# Altium schematic sheet Sheet2.SchDoc
size A4; SheetNumber: 1; SheetTotal: 3
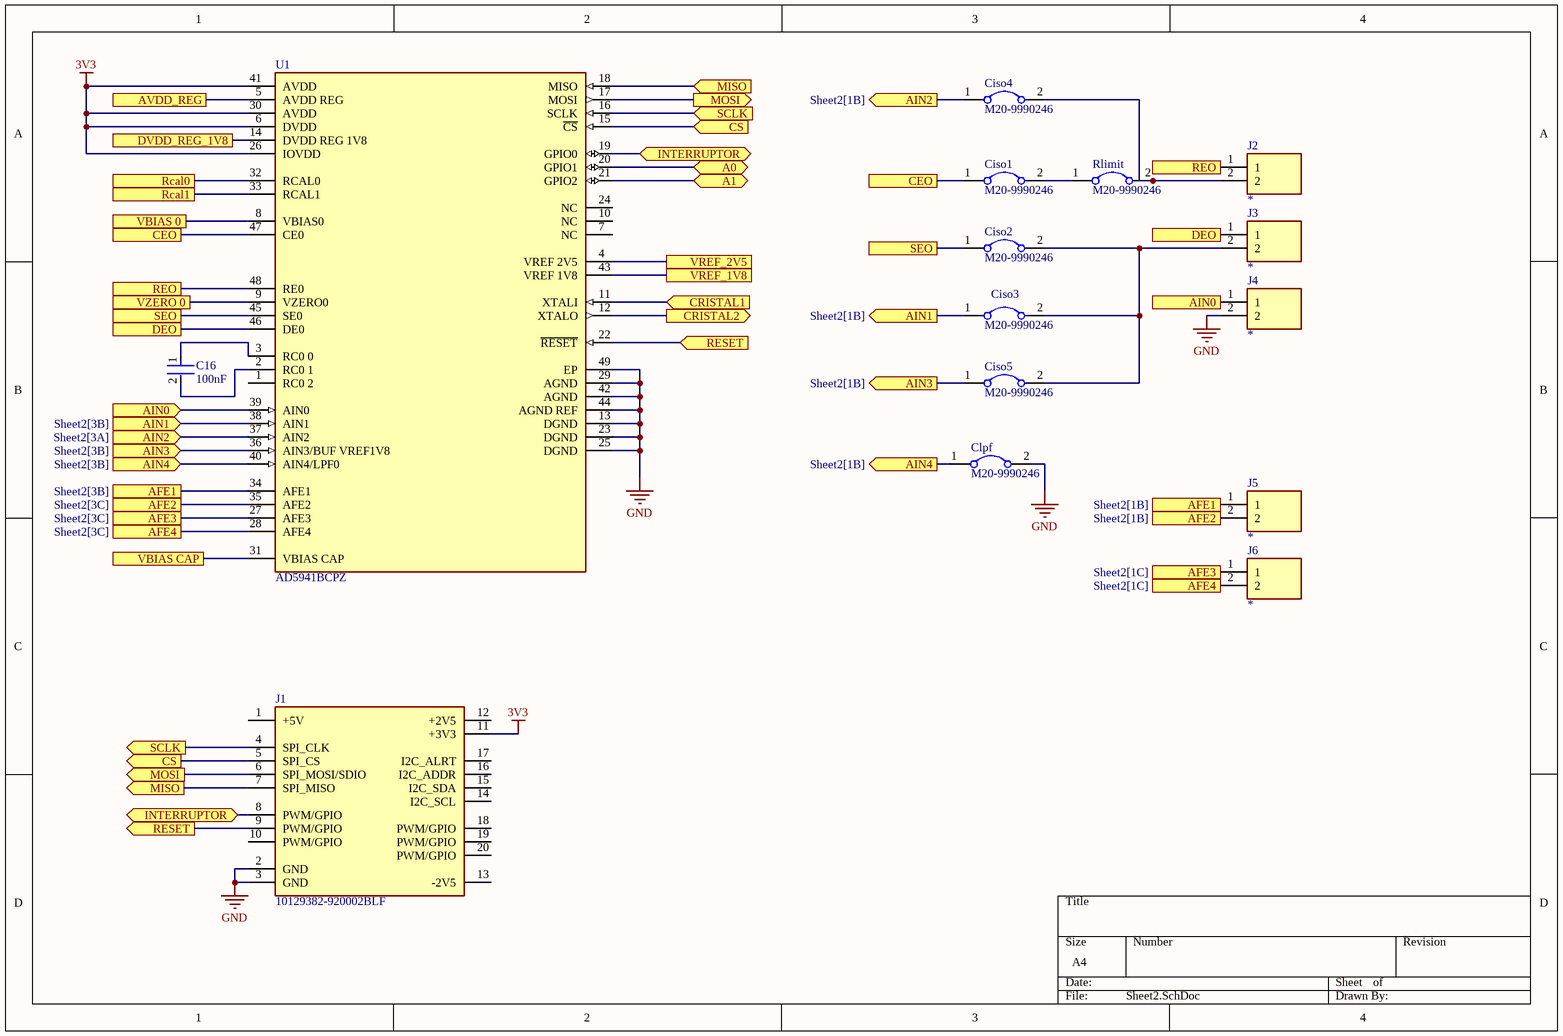
[diagram p0: Sheet2.SchDoc]

## Parts
C16  100nF  [FP-GRM18-0_15-MFG]
Ciso1  M20-9990246  [Male Header Socket 2-position]
Ciso2  M20-9990246  [Male Header Socket 2-position]
Ciso3  M20-9990246  [Male Header Socket 2-position]
Ciso4  M20-9990246  [Male Header Socket 2-position]
Ciso5  M20-9990246  [Male Header Socket 2-position]
Clpf  M20-9990246  [Male Header Socket 2-position]
J1  10129382-920002BLF  [Base Board Modular Connector (MALE)]
J2  (no value)  [Terminal Block 2-position]
J3  (no value)  [Terminal Block 2-position]
J4  (no value)  [Terminal Block 2-position]
J5  (no value)  [Terminal Block 2-position]
J6  (no value)  [Terminal Block 2-position]
Rlimit  M20-9990246  [Male Header Socket 2-position]
U1  AD5941BCPZ  [FP-CP-48-4-IPC_A]

## Ports
A0 (bidir, see Sheet3[1B]), A1 (bidir, see Sheet3[1B]), AFE1 (see Sheet2[1B]), AFE1 (see Sheet2[3B]), AFE2 (see Sheet2[1B]), AFE2 (see Sheet2[3C]), AFE3 (see Sheet2[1C]), AFE3 (see Sheet2[3C]), AFE4 (see Sheet2[1C]), AFE4 (see Sheet2[3C]), AIN0 (in, see Sheet2[3B]), AIN0 (out, see Sheet2[1B]), AIN1 (in, see Sheet2[3B]), AIN1 (out, see Sheet2[1B]), AIN2 (in, see Sheet2[3A]), AIN2 (out, see Sheet2[1B]), AIN3 (in, see Sheet2[3B]), AIN3 (out, see Sheet2[1B]), AIN4 (in, see Sheet2[3B]), AIN4 (out, see Sheet2[1B]), AVDD_REG (see Sheet4[2B]), CEO (see Sheet2[1A]), CEO (see Sheet2[3A]), CRISTAL1 (in, see Sheet4[3C]), CRISTAL2 (out, see Sheet4[4C]), CS (in, see Sheet2[1C]), CS (out, see Sheet2[2A]), DEO (see Sheet2[1B]), DEO (see Sheet2[3A]), DVDD_REG_1V8 (see Sheet4[2B]), INTERRUPTOR (bidir, see Sheet2[1D]), INTERRUPTOR (bidir, see Sheet2[2A]), MISO (in, see Sheet2[1D]), MISO (out, see Sheet2[2A]), MOSI (out, see Sheet2[1D]), MOSI (out, see Sheet2[2A]), Rcal0 (see Sheet3[2B]), Rcal1 (see Sheet3[3B]), REO (see Sheet2[1B]), REO (see Sheet2[3A]), RESET (in, see Sheet2[1D], Sheet4[3B]), RESET (out, see Sheet2[2B], Sheet4[3B]), SCLK (in, see Sheet2[1C]), SCLK (out, see Sheet2[2A]), SEO (see Sheet2[1B]), SEO (see Sheet2[3A]), VBIAS 0 (see Sheet4[2B]), VBIAS CAP (see Sheet4[1C]), VREF_1V8 (see Sheet4[2C]), VREF_2V5 (see Sheet4[1B]), VZERO 0 (see Sheet4[1C])

## Nets
3V3: J1.11(+3V3) U1.6(DVDD) U1.26(IOVDD) U1.30(AVDD) U1.41(AVDD)
GND: Clpf.2 J1.2(GND) J1.3(GND) J4.2 U1.13(DGND) U1.23(DGND) U1.25(DGND) U1.29(AGND) U1.42(AGND) U1.44(AGND_REF) U1.49(EP)
A0: U1.20(GPIO1) ; port A0
A1: U1.21(GPIO2) ; port A1
AFE1: J5.1 U1.34(AFE1) ; port AFE1
AFE2: J5.2 U1.35(AFE2) ; port AFE2
AFE3: J6.1 U1.27(AFE3) ; port AFE3
AFE4: J6.2 U1.28(AFE4) ; port AFE4
AIN0: J4.1 U1.39(AIN0) ; port AIN0
AIN1: Ciso3.1 U1.38(AIN1) ; port AIN1
AIN2: Ciso4.1 U1.37(AIN2) ; port AIN2
AIN3: Ciso5.1 U1.36(AIN3/BUF_VREF1V8) ; port AIN3
AIN4: Clpf.1 U1.40(AIN4/LPF0) ; port AIN4
AVDD_REG: U1.5(AVDD_REG) ; port AVDD_REG
CEO: Ciso1.1 U1.47(CE0) ; port CEO
CRISTAL1: U1.11(XTALI) ; port CRISTAL1
CRISTAL2: U1.12(XTALO) ; port CRISTAL2
CS: J1.5(SPI_CS) U1.15(~{CS}) ; port CS
DEO: J3.1 U1.46(DE0) ; port DEO
DVDD_REG_1V8: U1.14(DVDD_REG_1V8) ; port DVDD_REG_1V8
INTERRUPTOR: J1.8(PWM/GPIO) U1.19(GPIO0) ; port INTERRUPTOR
MISO: J1.7(SPI_MISO) U1.18(MISO) ; port MISO
MOSI: J1.6(SPI_MOSI/SDIO) U1.17(MOSI) ; port MOSI
Rcal0: U1.32(RCAL0) ; port Rcal0
Rcal1: U1.33(RCAL1) ; port Rcal1
REO: J2.1 U1.48(RE0) ; port REO
RESET: J1.9(PWM/GPIO) U1.22(~{RESET}) ; port RESET
SCLK: J1.4(SPI_CLK) U1.16(SCLK) ; port SCLK
SEO: Ciso2.1 U1.45(SE0) ; port SEO
VBIAS 0: U1.8(VBIAS0) ; port VBIAS 0
VBIAS CAP: U1.31(VBIAS_CAP) ; port VBIAS CAP
VREF_1V8: U1.43(VREF_1V8) ; port VREF_1V8
VREF_2V5: U1.4(VREF_2V5) ; port VREF_2V5
VZERO 0: U1.9(VZERO0) ; port VZERO 0
NetC16_1: C16.1 U1.3(RC0_0)
NetC16_2: C16.2 U1.2(RC0_1)
NetCiso1_2: Ciso1.2 Rlimit.1
NetCiso2_2: Ciso2.2 Ciso3.2 Ciso5.2 J3.2
NetCiso4_2: Ciso4.2 J2.2 Rlimit.2

Not connected (* = marked no-connect by the designer): J1 1(+5V) 10(PWM/GPIO) 12(+2V5) 13(-2V5) 14(I2C_SCL) 15(I2C_SDA) 16(I2C_ADDR) 17(I2C_ALRT) 18(PWM/GPIO) 19(PWM/GPIO) 20(PWM/GPIO); U1 1(RC0_2) 7(NC) 10(NC) 24(NC)

## Library data of the parts
C16 = CMP-2000-05448-2: CAP CER 10UF 10V X5R 0603; Manufacturer Part Number: GRM188R61A106KE69D; Manufacturer: Murata; Temperature Coefficient: 15%; Material: Ceramic; Tolerance: 10%; Device Class L1: Passive Components; ComponentLink2Description: Datasheet; Height: 0.95mm; Package: GRM18-0.15; Octopart: https://octopart.com/grm188r61a106ke69d-murata-22851381; Value: 10uF; Digikey Description: CAP CER 10UF 10V X5R 0603; Temperature Range High: +85°C; Temperature Range Low: -55°C; Temperature Characteristic: X5R; Capacitance: 10uF; RoHS: TRUE; Device Class L2: Capacitors; ComponentLink2URL: https://search.murata.co.jp/Ceramy/image/img/A01X/G101/ENG/GRM188R61A106KE69-01A.pdf; Device Class L3: Ceramic Capacitors; Lead Free: Yes; Mouser Description: Multilayer Ceramic Capacitors MLCC - SMD/SMT 0603 10uF 10volts X5R + - 10%; Category: Cap; Voltage Rating: 10V; Temperature: -55°C to +85°C; Automotive: No
Ciso1-Ciso5 Clpf Rlimit = M20-9990246 (JUMPER): Headers & Wire Housings M20 2 Position SIL VERTICAL PTH HEADER TIN; Supplier 1: DigiKey; Supplier Part Number 1: 952-2262-ND; Supplier 2: Mouser; Supplier Part Number 2: 855-M20-9990246; Supplier 3: Farnell; Supplier Part Number 3: M20-9990246
J1 = Base Board Modular Connector (MALE)
J2-J6 = TB0011-350-02BE: Fixed Terminal Blocks 2 Poles, Screw Type, Horizontal, 3.50 Pitch, 24-18 (AWG), Blue, Terminal Block Connector; Supplier 1: DigiKey; Supplier Part Number 1: 2223-TB0011-350-02BE-ND; Supplier 2: Mouser; Supplier Part Number 2: 179-TB0011-350-02BE; Supplier 3: Farnell; Supplier Part Number 3: TB0011-350-02BE; Parameter 1: *
U1 = CMP-09085-000021-2: BIO-IMPEDANCE & ELECTROCHEMICAL; RoHS Compliant: Yes